# Altium schematic sheet 1_PAGINA_INICIAL.SchDoc
size Tabloid; SheetNumber: 1; SheetTotal: 7
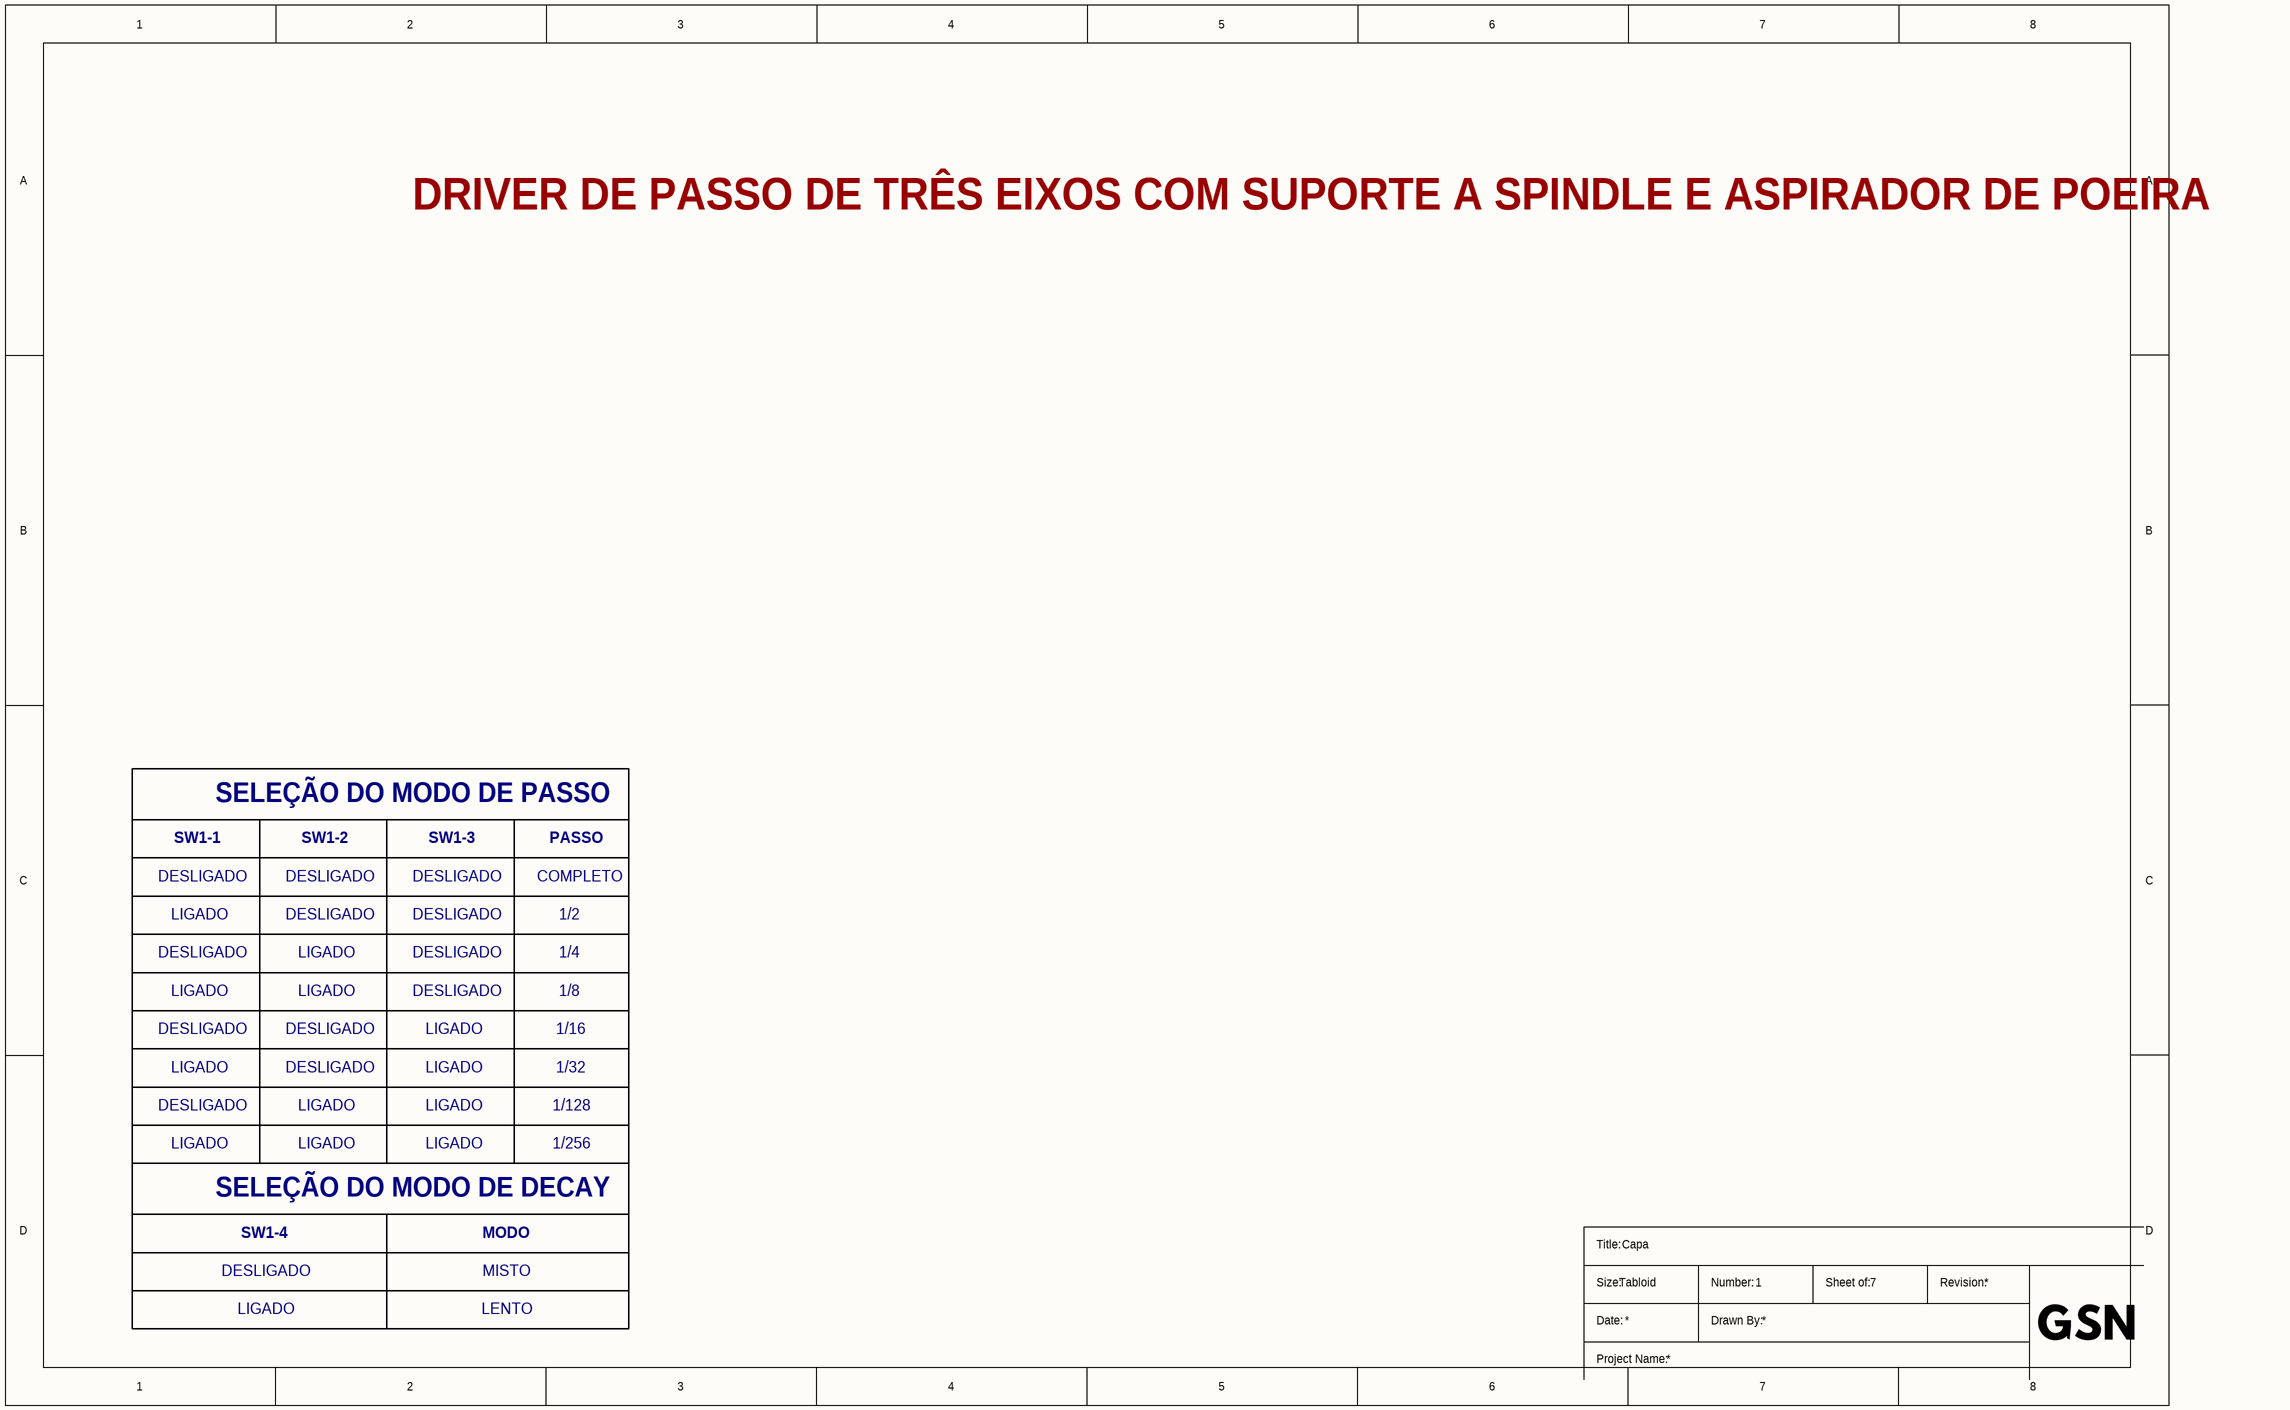
[diagram p0: 1_PAGINA_INICIAL.SchDoc]

## Notes on the sheet
- DRIVER DE PASSO DE TRÊS EIXOS COM SUPORTE A SPINDLE E ASPIRADOR DE POEIRA
- SW1-1
- SELEÇÃO DO MODO DE PASSO
- SW1-2
- SW1-3
- PASSO
- DESLIGADO
- LIGADO
- COMPLETO
- 1/2
- 1/4
- 1/16
- 1/8
- 1/128
- 1/32
- 1/256
- SELEÇÃO DO MODO DE DECAY
- SW1-4
- MODO
- MISTO
- Capa
- LENTO
- Title:
- Size:
- Tabloid
- Number:
- Sheet of:
- Revision:
- Date:
- Project Name:
- Drawn By: